# Altium schematic sheet LCD.SchDoc: LCD and additional circuitry
size A4; Author: Attila Sághy; DocumentNumber: 2; Revision: 11; SheetNumber: 2; SheetTotal: 3
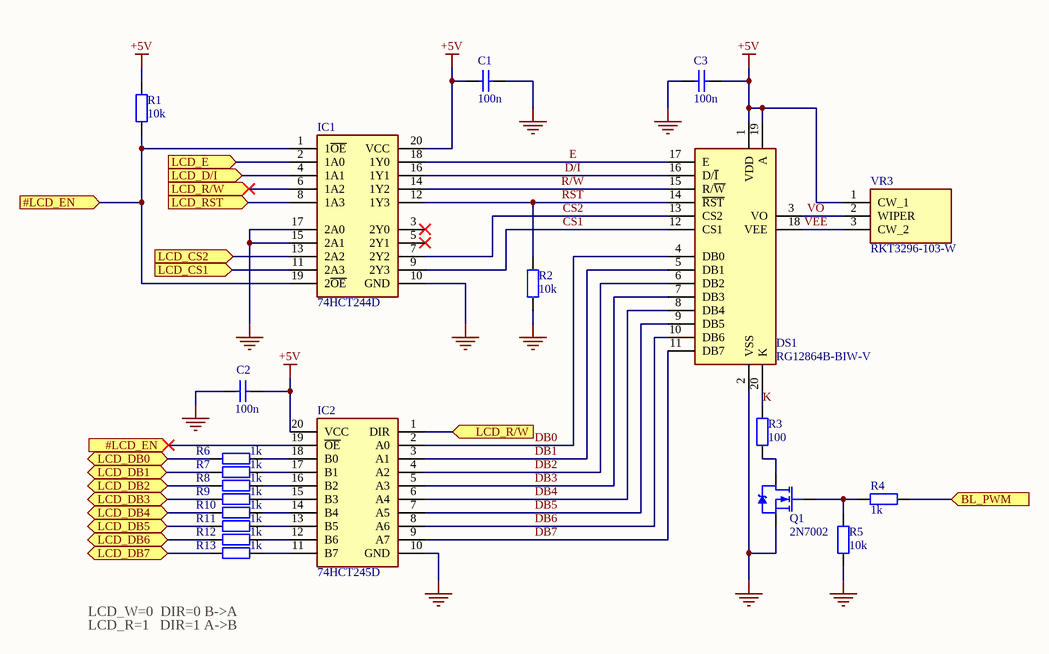
[diagram p0: LCD.SchDoc]

## Parts
C1  100n  [FP_0805_CAP_085]
C2  100n  [FP_0805_CAP_085]
C3  100n  [FP_0805_CAP_085]
DS1  RG12864B-BIW-V  [RG12864BBIWV]
IC1  74HCT244D  [SOIC127P1032X265-20N]
IC2  74HCT245D  [SOIC127P1032X265-20N]
Q1  2N7002  [FP_SOT23-3]
R1  10k  [FP_0805_RES]
R2  10k  [FP_0805_RES]
R3  100  [FP_0805_RES]
R4  1k  [FP_0805_RES]
R5  10k  [FP_0805_RES]
R6  1k  [FP_0805_RES]
R7  1k  [FP_0805_RES]
R8  1k  [FP_0805_RES]
R9  1k  [FP_0805_RES]
R10  1k  [FP_0805_RES]
R11  1k  [FP_0805_RES]
R12  1k  [FP_0805_RES]
R13  1k  [FP_0805_RES]
VR3  RKT3296-103-W  [RKT3296103W]

## Ports
#LCD_EN (in), BL_PWM (in), LCD_CS1 (in), LCD_CS2 (in), LCD_D/I (in), LCD_DB0 (bidir), LCD_DB1 (bidir), LCD_DB2 (bidir), LCD_DB3 (bidir), LCD_DB4 (bidir), LCD_DB5 (bidir), LCD_DB6 (bidir), LCD_DB7 (bidir), LCD_E (in), LCD_R/W (in), LCD_RST (in)

## Nets
+5V: C1.2 C2.1 C3.2 DS1.1(VDD) DS1.19(A) IC1.20(VCC) IC2.20(VCC) R1.2 VR3.1(CW_1)
GND: C1.1 C2.2 C3.1 DS1.2(VSS) IC1.10(GND) IC1.15(2A1) IC1.17(2A0) IC2.10(GND) Q1.3(S) R2.1 R5.1
#LCD_EN: IC1.1(1~{OE}) IC1.19(2~{OE}) IC2.19(~{OE}) R1.1 ; port #LCD_EN
BL_PWM: R4.1 ; port BL_PWM
CS1: DS1.12(CS1) IC1.9(2Y3)
CS2: DS1.13(CS2) IC1.7(2Y2)
D/I: DS1.16(D/~{I}) IC1.16(1Y1)
DB0: DS1.4(DB0) IC2.2(A0)
DB1: DS1.5(DB1) IC2.3(A1)
DB2: DS1.6(DB2) IC2.4(A2)
DB3: DS1.7(DB3) IC2.5(A3)
DB4: DS1.8(DB4) IC2.6(A4)
DB5: DS1.9(DB5) IC2.7(A5)
DB6: DS1.10(DB6) IC2.8(A6)
DB7: DS1.11(DB7) IC2.9(A7)
E: DS1.17(E) IC1.18(1Y0)
K: DS1.20(K) R3.2
LCD_CS1: IC1.11(2A3) ; port LCD_CS1
LCD_CS2: IC1.13(2A2) ; port LCD_CS2
LCD_D/I: IC1.4(1A1) ; port LCD_D/I
LCD_DB0: R6.1 ; port LCD_DB0
LCD_DB1: R7.1 ; port LCD_DB1
LCD_DB2: R8.1 ; port LCD_DB2
LCD_DB3: R9.1 ; port LCD_DB3
LCD_DB4: R10.1 ; port LCD_DB4
LCD_DB5: R11.1 ; port LCD_DB5
LCD_DB6: R12.1 ; port LCD_DB6
LCD_DB7: R13.1 ; port LCD_DB7
LCD_E: IC1.2(1A0) ; port LCD_E
LCD_R/W: IC1.6(1A2) IC2.1(DIR) ; port LCD_R/W
LCD_RST: IC1.8(1A3) ; port LCD_RST
R/W: DS1.15(R/~{W}) IC1.14(1Y2)
RST: DS1.14(~{RST}) IC1.12(1Y3) R2.2
VEE: DS1.18(VEE) VR3.3(CW_2)
VO: DS1.3(VO) VR3.2(WIPER)
NetIC2_11: IC2.11(B7) R13.2
NetIC2_12: IC2.12(B6) R12.2
NetIC2_13: IC2.13(B5) R11.2
NetIC2_14: IC2.14(B4) R10.2
NetIC2_15: IC2.15(B3) R9.2
NetIC2_16: IC2.16(B2) R8.2
NetIC2_17: IC2.17(B1) R7.2
NetIC2_18: IC2.18(B0) R6.2
NetQ1_1: Q1.1(G) R4.2 R5.2
NetQ1_2: Q1.2(D) R3.1

Not connected (* = marked no-connect by the designer): IC1 3(2Y0)* 5(2Y1)*

## Notes on the sheet
- LCD_W=0  DIR=0 B->A
- LCD_R=1   DIR=1 A->B
- Title
- Size:
- Date:
- A4
- Number:
- Time:
- Revision:
- Sheet
- of
- File:

## Library data of the parts
C1-C3 = CAP: Capacitor; Supplier: Lomex; Reference: 82-13-46; Name: Capacitor; Value: 100n
DS1 = RG12864B-BIW-V: Display; Manufacturer_Name: RAYSTAR; Datasheet Link: https://www.tme.eu/Document/ad0edd8197c217e1346010bf2253878c/RG12864B-GHW-V.pdf; Height: 5.9mm; Name: RG12864B-BIW-V; Supplier: Lomex; Reference: 37-00-81
IC1 = 74HCT244D: Buffer/Line driver; Manufacturer_Name: Nexperia; Name: 74HCT244D; Mouser Part Number: 771-74HCT244D; Mouser Price/Stock: https://www.mouser.com/Search/Refine.aspx?Keyword=771-74HCT244D; Supplier: Lomex; Reference: 87-05-95
IC2 = 74HCT245D: Bidirectional bus transceiver; Manufacturer_Name: Nexperia; Name: 74HCT245D; Mouser Part Number: N/A; Mouser Price/Stock: https://www.mouser.co.uk/ProductDetail/Nexperia/74HCT245D?qs=vHuUswq2%252Bswq%2FDWSRnGMaw%3D%3D; Reference: 87-06-35; Supplier: Lomex
Q1 = NMOS: pin to pad: 2>3 3>2; Supplier: Lomex; Reference: 86-00-97; Name: 2N7002
R1-R13 = RES: Resistor; Supplier: Lomex; Name: Resistor
  R1 R2 R5: Reference: 80-10-98; Value: 10k
  R3: Reference: 80-10-74; Value: 100
  R4 R6-R13: Reference: 80-10-86; Value: 1k
VR3 = RKT3296-103-W: Variable Resistor; Manufacturer_Name: Kings Electronics; Datasheet Link: https://www.kingtronics.com/pdf/RKT-3296.pdf; Height: 10mm; Name: RKT3296-103-W; Supplier: Lomex; Reference: 05-05-89